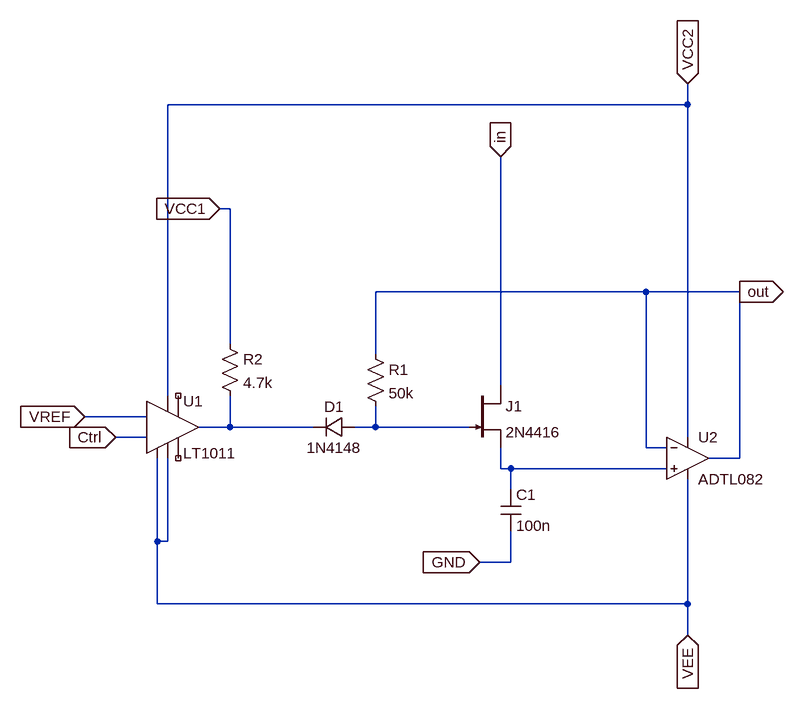
[diagram p0: schematic SH.asc]
SH.asc, the LTspice schematic file:
Version 4.1
SHEET 1 880 680
WIRE 608 -272 608 -304
WIRE 608 -272 -192 -272
WIRE -96 -112 -112 -112
WIRE 544 16 128 16
WIRE 688 16 544 16
WIRE -96 96 -96 -112
WIRE 128 112 128 16
WIRE 320 160 320 -192
WIRE -192 176 -192 -272
WIRE -224 208 -320 208
WIRE -96 224 -96 176
WIRE -96 224 -144 224
WIRE 32 224 -96 224
WIRE 128 224 128 192
WIRE 128 224 96 224
WIRE 272 224 128 224
WIRE -224 240 -272 240
WIRE 608 240 608 -272
WIRE 544 256 544 16
WIRE 576 256 544 256
WIRE 688 272 688 16
WIRE 688 272 640 272
WIRE 320 288 320 256
WIRE 336 288 320 288
WIRE 576 288 336 288
WIRE 336 320 336 288
WIRE -208 400 -208 272
WIRE -192 400 -192 272
WIRE -192 400 -208 400
WIRE 336 432 336 384
WIRE 336 432 288 432
WIRE -208 496 -208 400
WIRE 608 496 608 304
WIRE 608 496 -208 496
WIRE 608 544 608 496
FLAG 608 544 VEE
IOPIN 608 544 In
FLAG -272 240 Ctrl
IOPIN -272 240 In
FLAG -320 208 VREF
IOPIN -320 208 In
FLAG 288 432 GND
IOPIN 288 432 In
FLAG 608 -304 VCC2
IOPIN 608 -304 In
FLAG -112 -112 VCC1
IOPIN -112 -112 In
FLAG 688 16 out
IOPIN 688 16 Out
FLAG 320 -192 in
IOPIN 320 -192 In
SYMBOL res 112 96 R0
SYMATTR InstName R1
SYMATTR Value 50k
SYMBOL diode 96 240 M270
WINDOW 0 32 32 VTop 2
WINDOW 3 0 32 VBottom 2
SYMATTR InstName D1
SYMATTR Value 1N4148
SYMBOL Comparators\\LT1011 -192 224 R0
SYMATTR InstName U1
SYMBOL res -112 80 R0
SYMATTR InstName R2
SYMATTR Value 4.7k
SYMBOL OpAmps\\ADTL082 608 208 R0
SYMATTR InstName U2
SYMBOL njf 272 160 R0
SYMATTR InstName J1
SYMATTR Value 2N4416
SYMBOL cap 320 320 R0
SYMATTR InstName C1
SYMATTR Value 100n

The netlist it stands for:
* SH.asc
R1 out N002 50k
D1 N002 N001 1N4148
X§U1 VEE Ctrl VREF VEE NC_01 NC_02 N001 VCC2 LT1011
R2 VCC1 N001 4.7k
X§U2 N003 out VCC2 VEE out ADTL082  ; pins In+ In- V+ V- OUT
J1 in N002 N003 2N4416
C1 N003 GND 100n
.model D D
.lib standard.dio
.model NJF NJF
.model PJF PJF
.lib standard.jft
.lib LTC1.lib
.lib ADI.lib
.backanno
.end